# EAGLE schematic compactron-tube-amp (EAGLE 7.5.0)
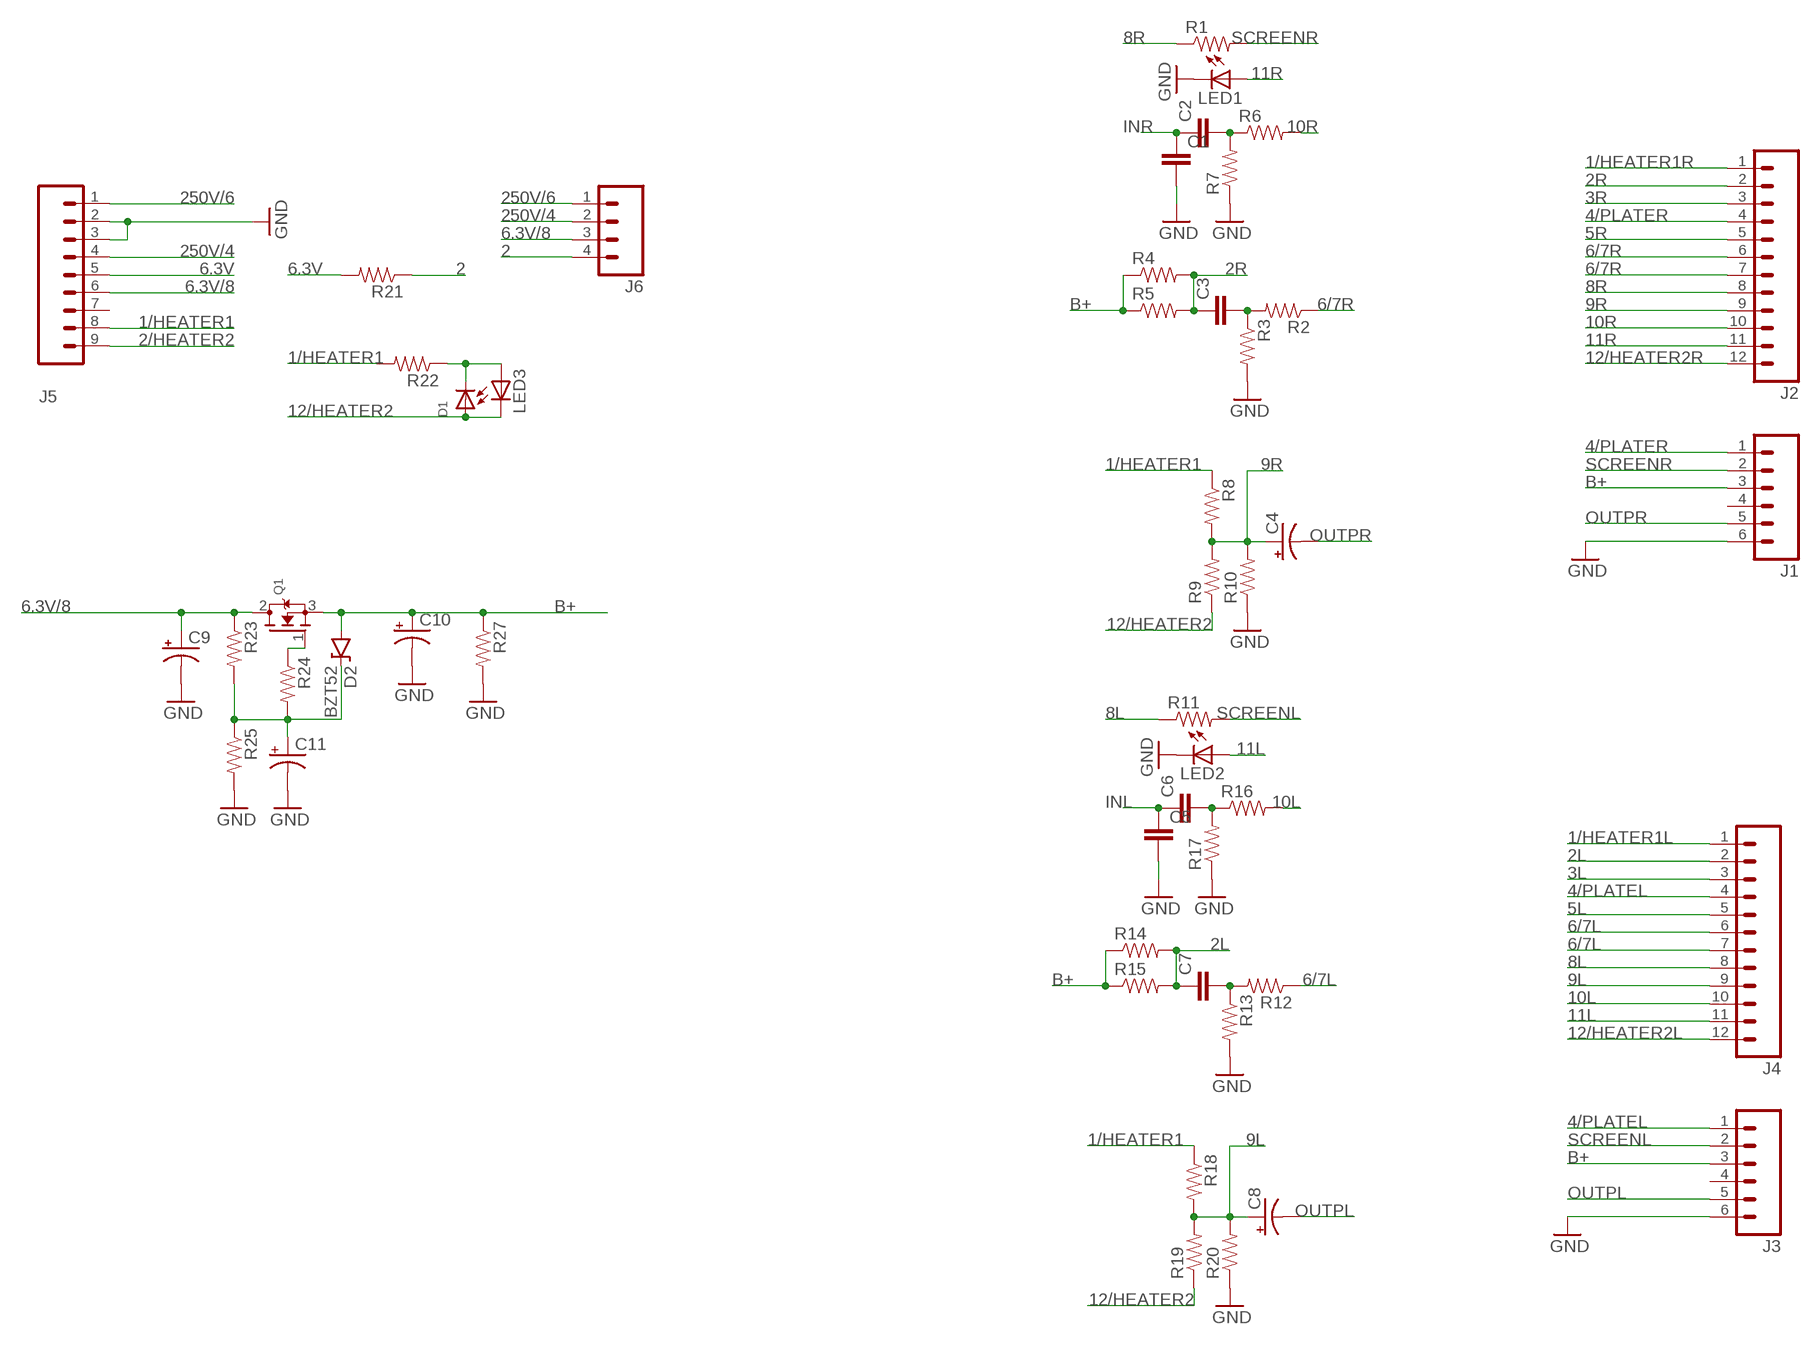
[diagram p0: schematic, sheet 1]

## Parts
C1  C-EU275-093X316  [C275-093X316]
C2  C-EU275-093X316  [C275-093X316]
C3  C-EU275-093X316  [C275-093X316]
C4  CPOL-USE22-10AXIAL  [E22-10]
C5  C-EU275-093X316  [C275-093X316]
C6  C-EU275-093X316  [C275-093X316]
C7  C-EU275-093X316  [C275-093X316]
C8  CPOL-USE22-10AXIAL  [E22-10]
C9  CPOL-USE22-10AXIAL  [E22-10]
C10  CPOL-USE22-10AXIAL  [E22-10]
C11  CPOL-USE22-10AXIAL  [E22-10]
D1  DIODEDO-1N4148  [DO-1N4148]
D2  BZT52  DIODE-ZENER  [DIODE-BZT52]
J1  M06LONGPADS  [1X06_LONGPADS]
J2  M12LONGPADS  [1X12_LONGPADS]
J3  M06LONGPADS  [1X06_LONGPADS]
J4  M12LONGPADS  [1X12_LONGPADS]
J5  M09LONGPADS  [1X09_LONGPADS]
J6  M04LONGPADS  [1X04_LONGPADS]
LED1  LED5MM  [LED5MM]
LED2  LED5MM  [LED5MM]
LED3  LED5MM  [LED5MM]
Q1  MOSFET-NGDS_TO220V  [TO220V]
R1  RESISTORPTH-2W  [AXIAL-0.8]
R2  RESISTORPTH-2W  [AXIAL-0.8]
R3  RESISTORPTH-2W  [AXIAL-0.8]
R4  RESISTORPTH-2W  [AXIAL-0.8]
R5  RESISTORPTH-2W  [AXIAL-0.8]
R6  RESISTORPTH-2W  [AXIAL-0.8]
R7  RESISTORPTH-2W  [AXIAL-0.8]
R8  RESISTORPTH-2W  [AXIAL-0.8]
R9  RESISTORPTH-2W  [AXIAL-0.8]
R10  RESISTORPTH-2W  [AXIAL-0.8]
R11  RESISTORPTH-2W  [AXIAL-0.8]
R12  RESISTORPTH-2W  [AXIAL-0.8]
R13  RESISTORPTH-2W  [AXIAL-0.8]
R14  RESISTORPTH-2W  [AXIAL-0.8]
R15  RESISTORPTH-2W  [AXIAL-0.8]
R16  RESISTORPTH-2W  [AXIAL-0.8]
R17  RESISTORPTH-2W  [AXIAL-0.8]
R18  RESISTORPTH-2W  [AXIAL-0.8]
R19  RESISTORPTH-2W  [AXIAL-0.8]
R20  RESISTORPTH-2W  [AXIAL-0.8]
R21  RESISTORPTH-2W  [AXIAL-0.8]
R22  RESISTORPTH-2W  [AXIAL-0.8]
R23  RESISTORPTH-2W  [AXIAL-0.8]
R24  RESISTORPTH-2W  [AXIAL-0.8]
R25  RESISTORPTH-2W  [AXIAL-0.8]
R27  RESISTORPTH-2W  [AXIAL-0.8]

## Nets
1/HEATER1: J5.8 R8.P$1 R18.P$1 R22.P$2
1/HEATER1L: J4.1
1/HEATER1R: J2.1
2: J6.4 R21.P$1
2/HEATER2: J5.9
2L: C7.1 J4.2 R14.P$2 R15.P$2
2R: C3.1 J2.2 R4.P$2 R5.P$2
3L: J4.3
3R: J2.3
4/PLATEL: J3.1 J4.4
4/PLATER: J1.1 J2.4
5L: J4.5
5R: J2.5
6.3V: J5.5 R21.P$2
6.3V/8: C9.+ J5.6 J6.3 Q1.2(D) R23.P$1
6/7L: J4.6 J4.7 R12.P$1
6/7R: J2.6 J2.7 R2.P$1
8L: J4.8 R11.P$1
8R: J2.8 R1.P$1
9L: C8.+ J4.9 R18.P$2 R19.P$2 R20.P$2
9R: C4.+ J2.9 R8.P$2 R9.P$2 R10.P$2
10L: J4.10 R16.P$2
10R: J2.10 R6.P$2
11L: J4.11 LED2.A
11R: J2.11 LED1.A
12/HEATER2: D1.A LED3.K(C) R9.P$1 R19.P$1
12/HEATER2L: J4.12
12/HEATER2R: J2.12
250V/4: J5.4 J6.2
250V/6: J5.1 J6.1
B+: C10.+ D2.A J1.3 J3.3 Q1.3(S) R4.P$1 R5.P$1 R14.P$1 R15.P$1 R27.P$1
GND: C1.2 C5.2 C9.- C10.- C11.- J1.6 J3.6 J5.2 J5.3 LED1.K(C) LED2.K(C) R3.P$2 R7.P$1 R10.P$1 R13.P$2 R17.P$1 R20.P$1 R25.P$2 R27.P$2
INL: C5.1 C6.1
INR: C1.1 C2.1
N$1: C7.2 R12.P$2 R13.P$1
N$2: C6.2 R16.P$1 R17.P$2
N$3: D1.C LED3.A R22.P$1
N$4: Q1.1(G) R24.P$1
N$7: C3.2 R2.P$2 R3.P$1
N$8: C11.+ D2.C R23.P$2 R24.P$2 R25.P$1
N$15: C2.2 R6.P$1 R7.P$2
OUTPL: C8.- J3.5
OUTPR: C4.- J1.5
SCREENL: J3.2 R11.P$2
SCREENR: J1.2 R1.P$2
Unconnected: J1.4 J3.4 J5.7

## Library data of the parts
C1-C3 C5-C7 = rcl:C-EU: CAPACITOR, European symbol
C4 C8-C11 = rcl:CPOL-US: POLARIZED CAPACITOR, American symbol
D1 = adafruit:DIODE: Diode SMADIODE - SMA Surface Mount Package 20V 1A Schottky Diode Digikey: 641-1014-6-ND DO-1N4148 - Through Hole Small Current Diode SOD-123 20V 1 A (.5mV Vf) Schottky Diode - Digikey: MBRX120TPMSCT-ND SOD-323 10V 570mA (.38mV Vf, 3ns) Schottky Diode - Digikey: ZLLS410CT-ND SOD-523 30V 30mA Schottky Diode (RB751S-40TE61) - Digikey: RB751S-40TE61CT-ND SOT23-R/W - SOT23 Package (R = Solder Paste/Reflow Ovens, W = Hand-Soldering) BAT54Film 40V 300mA - Digikey: 497-7162-1-ND
D2 = SparkFun-DiscreteSemi:DIODE-ZENER: Zener Diode Production Part - 8199 3.4V Zener Voltage; PROD-ID: DIO-08199
J1 J3 = SparkFun-Connectors:M06: Header 6 Standard 6-pin 0.1" header. Use with straight break away headers (SKU : PRT-00116), right angle break away headers (PRT-00553), swiss pins (PRT-00743), machine pins (PRT-00117), and female headers (PRT-00115). Molex polarized connector foot print use with SKU : PRT-08094 with associated crimp pins and housings. NOTES ON THE VARIANTS LOCK and LOCK_LONGPADS... This footprint was designed to help hold the alignment of a through-hole component (i.e. 6-pin header) while soldering it into place. You may notice that each hole has been shifted either up or down by 0.005 of an inch from it's more standard position (which is a perfectly straight line). This slight alteration caused the pins (the squares in the middle) to touch the edges of the holes. Because they are alternating, it causes a "brace" to hold the component in place. 0.005 has proven to be the perfect amount of "off-center" position when using our standard breakaway headers. Although looks a little odd when you look at the bare footprint, once you have a header in there, the alteration is very hard to notice. Also,if you push a header all the way into place, it is covered up entirely on the bottom side. This idea of altering the position of holes to aid alignment will be further integrated into the Sparkfun Library for other footprints. It can help hold any component with 3 or more connection pins.
J2 J4 = SparkFun-Connectors:M12: Header 12 Standard 12-pin 0.1" header. Use with straight break away headers (SKU : PRT-00116), right angle break away headers (PRT-00553), swiss pins (PRT-00743), machine pins (PRT-00117), and female headers (PRT-00115).
J5 = SparkFun-Connectors:M09: Header 9 Standard 9-pin 0.1" header. Use with straight break away headers (SKU : PRT-00116), right angle break away headers (PRT-00553), swiss pins (PRT-00743), machine pins (PRT-00117), and female headers (PRT-00115).
J6 = SparkFun-Connectors:M04: Header 4 Standard 4-pin 0.1" header. Use with straight break away headers (SKU : PRT-00116), right angle break away headers (PRT-00553), swiss pins (PRT-00743), machine pins (PRT-00117), and female headers (PRT-00115). Molex polarized connector foot print use with SKU : PRT-08231 with associated crimp pins and housings. 1MM SMD Version SKU: PRT-10208; PROD_ID: CONN-09696
LED1-LED3 = adafruit:LED: LED OSRAM: - CHIPLED LG R971, LG N971, LY N971, LG Q971, LY Q971, LO R971, LY R971 LH N974, LH R974 LS Q976, LO Q976, LY Q976 LO Q996 - Hyper CHIPLED LW Q18S LB Q993, LB Q99A, LB R99A - SideLED LS A670, LO A670, LY A670, LG A670, LP A670 LB A673, LV A673, LT A673, LW A673 LH A674 LY A675 LS A676, LA A676, LO A676, LY A676, LW A676 LS A679, LY A679, LG A679 - Hyper Micro SIDELED® LS Y876, LA Y876, LO Y876, LY Y876 LT Y87S - SmartLED LW L88C, LW L88S LB L89C, LB L89S, LG L890 LS L89K, LO L89K, LY L89K LS L896, LA L896, LO L896, LY L896 - TOPLED LS T670, LO T670, LY T670, LG T670, LP T670 LSG T670, LSP T670, LSY T670, LOP T670, LYG T670 LG T671, LOG T671, LSG T671 LB T673, LV T673, LT T673, LW T673 LH T674 LS T676, LA T676, LO T676, LY T676, LB T676, LH T676, LSB T676, LW T676 LB T67C, LV T67C, LT T67C, LS T67K, LO T67K, LY T67K, LW E67C LS E67B, LA E67B, LO E67B, LY E67B, LB E67C, LV E67C, LT E67C LW T67C LS T679, LY T679, LG T679 LS T770, LO T770, LY T770, LG T770, LP T770 LB T773, LV T773, LT T773, LW T773 LH T774 LS E675, LA E675, LY E675, LS T675 LS T776, LA T776, LO T776, LY T776, LB T776 LHGB T686 LT T68C, LB T68C - Hyper Mini TOPLED® LB M676 - Mini TOPLED Santana® LG M470 LS M47K, LO M47K, LY M47K Source: http://www.osram.convergy.de/
Q1 = adafruit:MOSFET-N: N-Channel Mosfet 2N7002E - 60V 260mA SOT23 [Digikey: 2N7002ET1GOSTR-ND] - REEL BSH103 - 30V 850mA SOT23 [Digikey: 568-5013-1-ND]
R1-R25 R27 = SparkFun-Resistors:RESISTOR: Resistor Basic schematic elements and footprints for 0603, 1206, and PTH resistors.